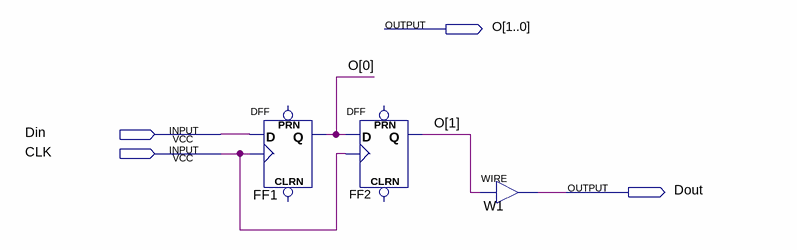
[diagram p0: schematic sheet]
// Quartus schematic 2_bit_shiftreg.bdf as structural Verilog: 3 symbols, 4 pins
module \2_bit_shiftreg  (
  input  Din,
  input  CLK,
  output [1:0] O,
  output Dout
);

  DFF FF1 (.CLK(CLK), .D(Din), .Q(O[0]));  // open: CLRN, PRN
  DFF FF2 (.CLK(CLK), .D(O[0]), .Q(O[1]));  // open: CLRN, PRN
  assign Dout = O[1];  // WIRE W1
endmodule
